# EAGLE design LED_Matrix (EAGLE 7.4.0)
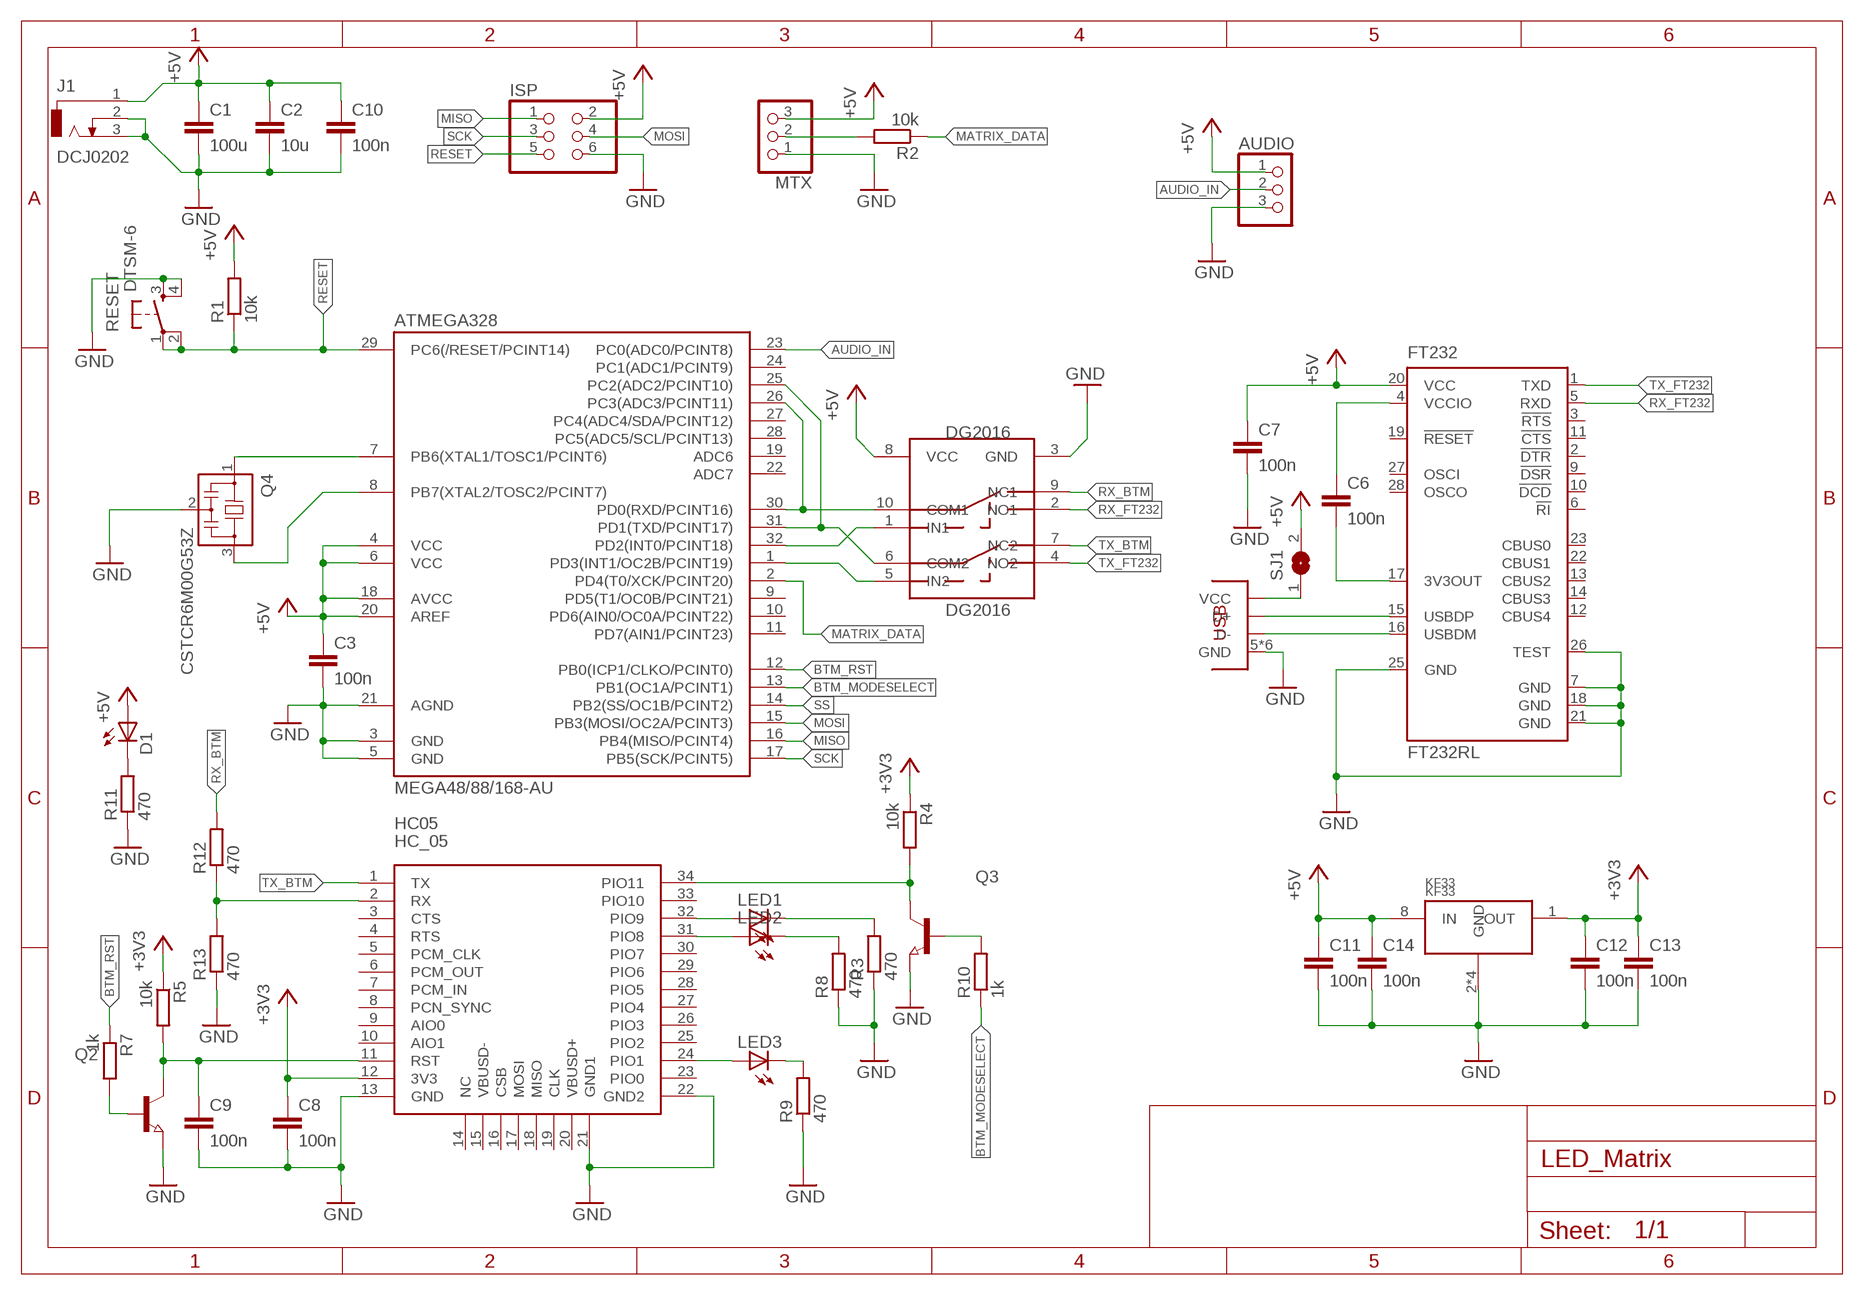
[diagram p0: schematic, sheet 1]

## Parts
ATMEGA328  MEGA48/88/168-AU  [TQFP32-08]
AUDIO  PINHD-1X3  [1X03]
C1  100u  C-EUC0805  [C0805]
C2  10u  C-EUC0805  [C0805]
C3  100n  C-EUC0805  [C0805]
C6  100n  C-EUC0805  [C0805]
C7  100n  C-EUC0805  [C0805]
C8  100n  C-EUC0805  [C0805]
C9  100n  C-EUC0805  [C0805]
C10  100n  C-EUC0805  [C0805]
C11  100n  C-EUC0805  [C0805]
C12  100n  C-EUC0805  [C0805]
C13  100n  C-EUC0805  [C0805]
C14  100n  C-EUC0805  [C0805]
D1  LEDSML0805  [SML0805]
DG2016  DG2016  [MSOP10]
FT232  FT232RL  [SSOP28]
HC05  HC_05  [BLUETOOTH_SMD]
ISP  PINHD-2X3  [2X03]
J1  DCJ0202  [DCJ0202]
KF33  KF33  [SO08]
LED1  LEDSML0805  [SML0805]
LED2  LEDSML0805  [SML0805]
LED3  LEDSML0805  [SML0805]
MTX  PINHD-1X3  [1X03]
Q2  NPN-TRANSISTOR_SOT23  [SOT23]
Q3  NPN-TRANSISTOR_SOT23  [SOT23]
Q4  CSTCR6M00G53Z  [CSTCR6M]
R1  10k  R-EU_R0805  [R0805]
R2  10k  R-EU_R0805  [R0805]
R3  470  R-EU_R0805  [R0805]
R4  10k  R-EU_R0805  [R0805]
R5  10k  R-EU_R0805  [R0805]
R7  1k  R-EU_R0805  [R0805]
R8  470  R-EU_R0805  [R0805]
R9  470  R-EU_R0805  [R0805]
R10  1k  R-EU_R0805  [R0805]
R11  470  R-EU_R0805  [R0805]
R12  470  R-EU_R0805  [R0805]
R13  470  R-EU_R0805  [R0805]
RESET  DTSM-6  [DTSM-6]
SJ1  SJ  [SJ]
USB  MINI_USB  [USB_MINI]

## Nets
+3V3: C8.1 C12.1 C13.1 HC05.12(3V3) KF33.1(OUT) R4.1 R5.1
+5V: ATMEGA328.4(VCC) ATMEGA328.6(VCC) ATMEGA328.18(AVCC) ATMEGA328.20(AREF) AUDIO.1 C1.1 C2.1 C3.1 C7.1 C10.1 C11.1 C14.1 D1.A DG2016.8(VCC) FT232.20(VCC) ISP.2 J1.1 KF33.8(IN) MTX.3 R1.2 SJ1.2
AUDIO_IN: ATMEGA328.23(PC0(ADC0/PCINT8)) AUDIO.2
BTM_MODESELECT: ATMEGA328.13(PB1(OC1A/PCINT1)) HC05.34(PIO11) Q3.3(C) R4.2 R10.1
BTM_RST: ATMEGA328.12(PB0(ICP1/CLKO/PCINT0)) R7.1
GND: ATMEGA328.3(GND) ATMEGA328.5(GND) ATMEGA328.21(AGND) AUDIO.3 C1.2 C2.2 C3.2 C7.2 C8.2 C9.2 C10.2 C11.2 C12.2 C13.2 C14.2 DG2016.3(GND) FT232.7(GND) FT232.18(GND) FT232.21(GND) FT232.25(GND) FT232.26(TEST) HC05.13(GND) HC05.21(GND1) HC05.22(GND2) ISP.6 J1.2 J1.3 KF33.2(GND) KF33.3(GND) KF33.6(GND) KF33.7(GND) MTX.1 Q2.2(E) Q3.2(E) Q4.2 R3.1 R8.1 R9.1 R11.1 R13.1 RESET.3 RESET.4 USB.5(GND) USB.GND USB.GND1(GND) USB.GND3(GND) USB.GND4(GND) USB.GND5(GND)
MATRIX_DATA: ATMEGA328.2(PD4(T0/XCK/PCINT20)) R2.1
MISO: ATMEGA328.16(PB4(MISO/PCINT4)) ISP.1
MOSI: ATMEGA328.15(PB3(MOSI/OC2A/PCINT3)) ISP.4
N$1: HC05.32(PIO9) LED1.A
N$2: SJ1.1 USB.1(VCC)
N$3: ATMEGA328.7(PB6(XTAL1/TOSC1/PCINT6)) Q4.1
N$4: MTX.2 R2.2
N$5: HC05.31(PIO8) LED2.A
N$6: LED1.C R3.2
N$7: ATMEGA328.8(PB7(XTAL2/TOSC2/PCINT7)) Q4.3
N$8: LED2.C R8.2
N$9: C6.1 FT232.4(VCCIO)
N$10: D1.C R11.2
N$11: C6.2 FT232.17(3V3OUT)
N$12: ATMEGA328.26(PC3(ADC3/PCINT11)) ATMEGA328.30(PD0(RXD/PCINT16)) DG2016.10(COM1)
N$13: FT232.16(USBDM) USB.2(D-)
N$14: FT232.15(USBDP) USB.3(D+)
N$15: ATMEGA328.25(PC2(ADC2/PCINT10)) ATMEGA328.31(PD1(TXD/PCINT17)) DG2016.6(COM2)
N$19: Q2.1(B) R7.2
N$23: C9.1 HC05.11(RST) Q2.3(C) R5.2
N$24: HC05.24(PIO1) LED3.A
N$25: LED3.C R9.2
N$26: HC05.2(RX) R12.1 R13.2
N$27: Q3.1(B) R10.2
N$28: ATMEGA328.32(PD2(INT0/PCINT18)) DG2016.1(IN1)
N$29: ATMEGA328.1(PD3(INT1/OC2B/PCINT19)) DG2016.5(IN2)
RESET: ATMEGA328.29(PC6(/RESET/PCINT14)) ISP.5 R1.1 RESET.1 RESET.2
RX_BTM: DG2016.9(NC1) R12.2
RX_FT232: DG2016.2(NO1) FT232.5(RXD)
SCK: ATMEGA328.17(PB5(SCK/PCINT5)) ISP.3
SS: ATMEGA328.14(PB2(SS/OC1B/PCINT2))
TX_BTM: DG2016.7(NC2) HC05.1(TX)
TX_FT232: DG2016.4(NO2) FT232.1(TXD)
Unconnected: ATMEGA328.9(PD5(T1/OC0B/PCINT21)) ATMEGA328.10(PD6(AIN0/OC0A/PCINT22)) ATMEGA328.11(PD7(AIN1/PCINT23)) ATMEGA328.19(ADC6) ATMEGA328.22(ADC7) ATMEGA328.24(PC1(ADC1/PCINT9)) ATMEGA328.27(PC4(ADC4/SDA/PCINT12)) ATMEGA328.28(PC5(ADC5/SCL/PCINT13)) FT232.2(!DTR) FT232.3(!RTS) FT232.6(!RI) FT232.9(!DSR) FT232.10(!DCD) FT232.11(!CTS) FT232.12(CBUS4) FT232.13(CBUS2) FT232.14(CBUS3) FT232.19(!RESET) FT232.22(CBUS1) FT232.23(CBUS0) FT232.27(OSCI) FT232.28(OSCO) HC05.3(CTS) HC05.4(RTS) HC05.5(PCM_CLK) HC05.6(PCM_OUT) HC05.7(PCM_IN) HC05.8(PCN_SYNC) HC05.9(AIO0) HC05.10(AIO1) HC05.14(NC) HC05.15(VBUSD-) HC05.16(CSB) HC05.17(MOSI) HC05.18(MISO) HC05.19(CLK) HC05.20(VBUSD+) HC05.23(PIO0) HC05.25(PIO2) HC05.26(PIO3) HC05.27(PIO4) HC05.28(PIO5) HC05.29(PIO6) HC05.30(PIO7) HC05.33(PIO10)

## Library data of the parts
ATMEGA328 = avr-5:MEGA48/88/168
AUDIO MTX = pinhead:PINHD-1X3: PIN HEADER
C1-C3 C6-C14 = rcl:C-EU: CAPACITOR, European symbol
D1 LED1-LED3 = led:LED: LED OSRAM: - CHIPLED LG R971, LG N971, LY N971, LG Q971, LY Q971, LO R971, LY R971 LH N974, LH R974 LS Q976, LO Q976, LY Q976 LO Q996 - Hyper CHIPLED LW Q18S LB Q993, LB Q99A, LB R99A - SideLED LS A670, LO A670, LY A670, LG A670, LP A670 LB A673, LV A673, LT A673, LW A673 LH A674 LY A675 LS A676, LA A676, LO A676, LY A676, LW A676 LS A679, LY A679, LG A679 - Hyper Micro SIDELED® LS Y876, LA Y876, LO Y876, LY Y876 LT Y87S - SmartLED LW L88C, LW L88S LB L89C, LB L89S, LG L890 LS L89K, LO L89K, LY L89K LS L896, LA L896, LO L896, LY L896 - TOPLED LS T670, LO T670, LY T670, LG T670, LP T670 LSG T670, LSP T670, LSY T670, LOP T670, LYG T670 LG T671, LOG T671, LSG T671 LB T673, LV T673, LT T673, LW T673 LH T674 LS T676, LA T676, LO T676, LY T676, LB T676, LH T676, LSB T676, LW T676 LB T67C, LV T67C, LT T67C, LS T67K, LO T67K, LY T67K, LW E67C LS E67B, LA E67B, LO E67B, LY E67B, LB E67C, LV E67C, LT E67C LW T67C LS T679, LY T679, LG T679 LS T770, LO T770, LY T770, LG T770, LP T770 LB T773, LV T773, LT T773, LW T773 LH T774 LS E675, LA E675, LY E675, LS T675 LS T776, LA T776, LO T776, LY T776, LB T776 LHGB T686 LT T68C, LB T68C - Hyper Mini TOPLED® LB M676 - Mini TOPLED Santana® LG M470 LS M47K, LO M47K, LY M47K Source: http://www.osram.convergy.de LUXEON: - LUMILED® LXK2-PW12-R00, LXK2-PW12-S00, LXK2-PW14-U00, LXK2-PW14-V00 LXK2-PM12-R00, LXK2-PM12-S00, LXK2-PM14-U00 LXK2-PE12-Q00, LXK2-PE12-R00, LXK2-PE12-S00, LXK2-PE14-T00, LXK2-PE14-U00 LXK2-PB12-K00, LXK2-PB12-L00, LXK2-PB12-M00, LXK2-PB14-N00, LXK2-PB14-P00, LXK2-PB14-Q00 LXK2-PR12-L00, LXK2-PR12-M00, LXK2-PR14-Q00, LXK2-PR14-R00 LXK2-PD12-Q00, LXK2-PD12-R00, LXK2-PD12-S00 LXK2-PH12-R00, LXK2-PH12-S00 LXK2-PL12-P00, LXK2-PL12-Q00, LXK2-PL12-R00 Source: www.luxeon.com KINGBRIGHT: KA-3528ASYC Source: www.kingbright.com
DG2016 = Tobias:DG2016: The DG2016/DG2026 are monolithic CMOS dual single-pole/double-throw (SPDT) analog switchs. They are specifically designed for low-voltage, high bandwidth applications. The DG2016/DG2026’s on-resistance (3  at 2.7 V), matching and flatness are guaranteed over the entire analog voltage range. Wide dynamic performance is achieved with better than - 80 dB for both cross-talk and off-isolation at 1 MHz. Both SPDT’s operate with independent control logic, conduct equally well in both directions and block signals up to the power supply level when off. Break-before-make is guaranteed. With fast switching speeds, low on-resistance, high bandwidth, and low charge injection, the DG2016/DG2026 are ideally suited for audio and video switching with high linearity. Built on Vishay Siliconix’s low voltage CMOS technology, the DG2016/DG2026 contain an epitaxial layer which prevents latch-up
FT232 = ftdichip:FT232R: Source: http://www.ftdichip.com/Documents/DataSheets/DS_FT232R_v104.pdf; MPN: FT232RL; OC_FARNELL: 1146032; OC_NEWARK: 91K9918
HC05 = debegr92:HC_05
ISP = pinhead:PINHD-2X3: PIN HEADER
J1 = con-jack:DCJ0202: DC POWER JACK Source: DCJ0202.pdf; OC_FARNELL: unknown; OC_NEWARK: unknown
KF33 = debegr92:KF33
Q2 Q3 = semicon-smd-ipc:NPN-TRANSISTOR_: NPN TRANSISTOR
Q4 = murata-filter:CSTCR: Resonator Source: murata.co.jp; MPN: CSTCR6M00G53-R0; OC_FARNELL: 1170434; OC_NEWARK: 25M8759
R1-R5 R7-R13 = rcl:R-EU_: RESISTOR, European symbol
RESET = debegr92:DTSM-6
SJ1 = jumper:SJ: SMD solder JUMPER
USB = Tobias:MINI_USB

## Board
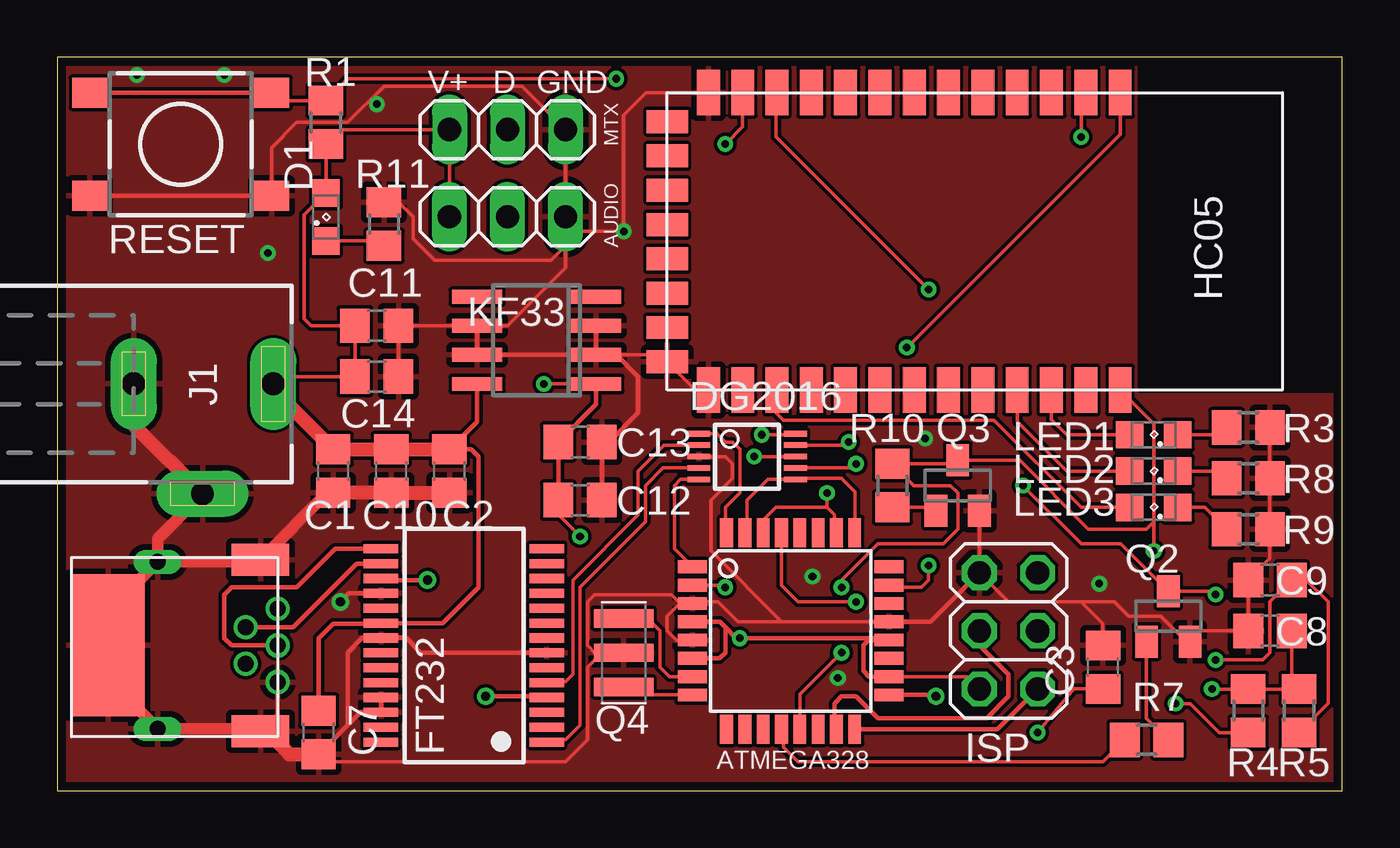
[diagram p1: board, top side]
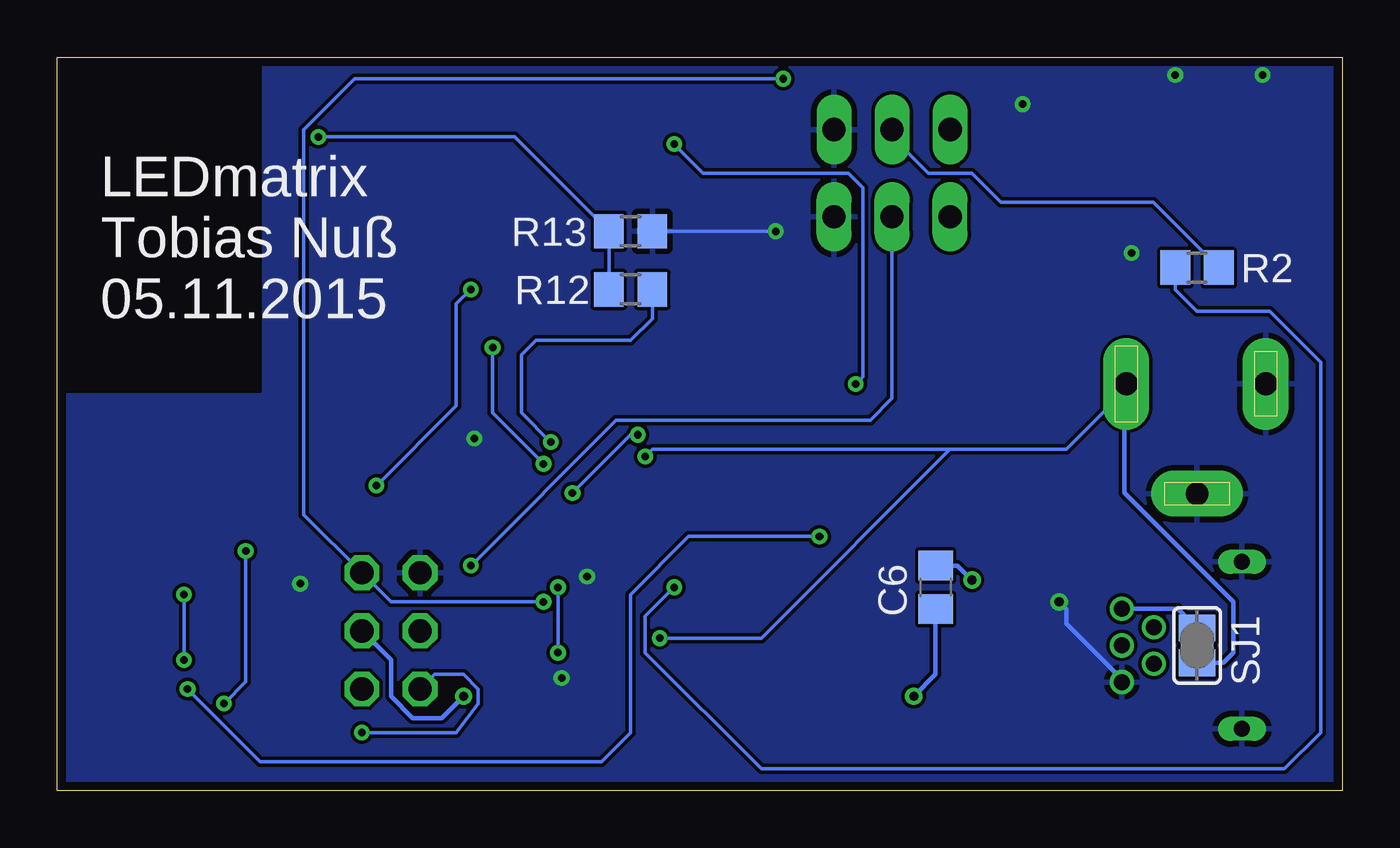
[diagram p2: board, bottom side, seen from below]

Size 56.19 x 32.06 mm. Coordinates in mm from the lower left corner, seen from the top.
Outline: 0,0 56.19,0 56.19,32.06 0,32.06 0,0
Copper layers (1*16): Top 0.0356mm / dielectric 1.5011mm / Bottom 0.0356mm
Design rules "LaenPCBOrder": minimum track width 6mil, minimum drill 13mil, track to track 6mil, track to pad 6mil, pad to pad 6mil, via to via 6mil, smd to smd 6mil, copper to edge 15mil, drill to drill 6mil, minimum pad ring 7mil, minimum via ring 7mil, stop-mask expansion 3mil, vias tented up to drill 0mil, thermal gap 10mil
tRestrict: area 47.3,17.5 to 56.2,32.1
bRestrict: area 47.3,17.5 to 56.2,32.1

### Footprints (pad centres in the part's own frame; a part is rotated, then mirrored left to right if it is on the bottom)
TQFP32-08 = smd 1.27 x 0.559: 1 -4.293,2.8; 2 -4.293,2; 3 -4.293,1.2; 4 -4.293,0.4; 5 -4.293,-0.4; 6 -4.293,-1.2; 7 -4.293,-2; 8 -4.293,-2.8; 17 4.293,-2.8; 18 4.293,-2; 19 4.293,-1.2; 20 4.293,-0.4; 21 4.293,0.4; 22 4.293,1.2; 23 4.293,2; 24 4.293,2.8 | smd 0.559 x 1.27: 9 -2.8,-4.293; 10 -2,-4.293; 11 -1.2,-4.293; 12 -0.4,-4.293; 13 0.4,-4.293; 14 1.2,-4.293; 15 2,-4.293; 16 2.8,-4.293; 25 2.8,4.293; 26 2,4.293; 27 1.2,4.293; 28 0.4,4.293; 29 -0.4,4.293; 30 -1.2,4.293; 31 -2,4.293; 32 -2.8,4.293
1X03 = drill 1.016 long: 1 -2.54,0; 2 0,0; 3 2.54,0
C0805 = smd 1.3 x 1.5: 1 -0.95,0; 2 0.95,0
SML0805 = smd 1.2 x 1.2: A 1.05,0; C -1.05,0
MSOP10 = smd 0.25 x 1: 1 -1,-2.113; 2 -0.5,-2.113; 3 0,-2.113; 4 0.5,-2.113; 5 1,-2.113; 6 1,2.113; 7 0.5,2.113; 8 0,2.113; 9 -0.5,2.113; 10 -1,2.113
SSOP28 = smd 0.4 x 1.5: 1 -4.225,-3.625; 2 -3.575,-3.625; 3 -2.925,-3.625; 4 -2.275,-3.625; 5 -1.625,-3.625; 6 -0.975,-3.625; 7 -0.325,-3.625; 8 0.325,-3.625; 9 0.975,-3.625; 10 1.625,-3.625; 11 2.275,-3.625; 12 2.925,-3.625; 13 3.575,-3.625; 14 4.225,-3.625; 15 4.225,3.625; 16 3.575,3.625; 17 2.925,3.625; 18 2.275,3.625; 19 1.625,3.625; 20 0.975,3.625; 21 0.325,3.625; 22 -0.325,3.625; 23 -0.975,3.625; 24 -1.625,3.625; 25 -2.275,3.625; 26 -2.925,3.625; 27 -3.575,3.625; 28 -4.225,3.625
BLUETOOTH_SMD = smd 2 x 1: 1 -6.7,7.1; 2 -6.7,5.6; 3 -6.7,4.1; 4 -6.7,2.6; 5 -6.7,1.1; 6 -6.7,-0.4; 7 -6.7,-1.9; 8 -6.7,-3.4; 9 -6.7,-4.9; 10 -6.7,-6.4; 11 -6.7,-7.9; 12 -6.7,-9.4; 13 -6.7,-10.9; 22 6.3,-10.9; 23 6.3,-9.4; 24 6.3,-7.9; 25 6.3,-6.4; 26 6.3,-4.9; 27 6.3,-3.4; 28 6.3,-1.9; 29 6.3,-0.4; 30 6.3,1.1; 31 6.3,2.6; 32 6.3,4.1; 33 6.3,5.6; 34 6.3,7.1 | smd 1 x 1.8: 14 -5.43,-12.7; 15 -3.93,-12.7; 16 -2.43,-12.7; 17 -0.93,-12.7; 18 0.57,-12.7; 19 2.07,-12.7; 20 3.57,-12.7; 21 5.07,-12.7
2X03 = drill 1.016 octagon: 1 -2.54,-1.27; 2 -2.54,1.27; 3 0,-1.27; 4 0,1.27; 5 2.54,-1.27; 6 2.54,1.27
DCJ0202 = drill 1 pad 2 long: 1 0,3.1; 2 4.8,0; 3 0,-3
SO08 = smd 0.6 x 2.2: 1 -1.905,-2.6; 2 -0.635,-2.6; 3 0.635,-2.6; 4 1.905,-2.6; 5 1.905,2.6; 6 0.635,2.6; 7 -0.635,2.6; 8 -1.905,2.6
SOT23 = smd 1 x 1.4: 1 -0.95,-1.1; 2 0.95,-1.1; 3 0,1.1
CSTCR6M = smd 0.8 x 2.6: 1 -1.5,0; 2 0,0; 3 1.5,0
R0805 = smd 1.3 x 1.5: 1 -0.95,0; 2 0.95,0
DTSM-6 = smd 1.55 x 1.3: 1 -3.975,2.25; 2 3.975,2.25; 3 -3.975,-2.25; 4 3.975,-2.25
SJ = smd 1.168 x 1.6: 1 -0.762,0; 2 0.762,0
USB_MINI = drill 0.7: 1 9,1.6; 2 7.6,0.8; 3 9,0; 4 7.6,-0.8; 5 9,-1.6 | smd 3.2 x 6.2: GND 1.6,0 | smd 2.5 x 1.4: GND1 8.25,3.75; GND3 8.25,-3.75 | drill 0.7 long: GND4 3.75,3.65; GND5 3.75,-3.65

### Placement (x,y rotation side)
ATMEGA328  32.07,6.99 0 top
AUDIO  19.68,25.08 0 top
C1  12.06,13.97 270 top
C2  17.14,13.97 270 top
C3  45.72,5.4 90 top
C6  17.78,8.89 90 bottom
C7  11.43,2.54 270 top
C8  53.02,6.99 180 top
C9  53.02,9.21 180 top
C10  14.61,13.97 270 top
C11  13.97,20.32 0 top
C12  22.86,12.7 0 top
C13  22.86,15.24 0 top
C14  13.97,18.1 0 top
D1  11.75,25.08 90 top
DG2016  30.16,14.61 270 top
FT232  17.78,6.35 90 top
HC05  39.37,23.81 270 top
ISP  41.59,6.99 90 top
J1  6.35,17.78 270 top
KF33  20.95,19.68 90 top
LED1  47.94,15.56 180 top
LED2  47.94,13.97 180 top
LED3  47.94,12.38 180 top
MTX  19.68,28.89 180 top
Q2  48.58,7.62 0 top
Q3  39.37,13.34 0 top
Q4  24.77,6.03 270 top
R1  11.75,29.21 270 top
R2  6.35,22.86 0 bottom
R3  52.07,15.88 180 top
R4  52.07,3.49 270 top
R5  54.29,3.49 270 top
R7  47.62,2.22 0 top
R8  52.07,13.65 180 top
R9  52.07,11.43 180 top
R10  36.51,13.34 270 top
R11  14.29,24.77 270 top
R12  31.11,21.91 0 bottom
R13  31.11,24.45 180 bottom
RESET  5.4,28.26 0 top
SJ1  6.35,6.35 270 bottom
USB  0.64,6.35 0 top

### Tracks (layer width: path | path; a pad name or v marks a point on that pad's centre or on a via)
+3V3  (via drill 0.33)
  Top 0.152: KF33.1 v21.27,17.78 | v29.21,28.26 29.97,29.02 HC05.12 | C8.1 53.97,4.76 R5.1 R4.1 v50.48,4.45 | v22.86,11.11 21.91,12.06 C12.1
  Top 0.203: KF33.1 23.55,16.89 C13.1 C12.1
  Bottom 0.152: v21.27,17.78 20.95,18.1 20.95,26.35 21.59,26.99 27.94,26.99 v29.21,28.26 | v50.48,4.45 47.31,1.27 32.38,1.27 31.11,2.54 31.11,8.57 28.57,11.11 v22.86,11.11
+5V  (via drill 0.33)
  Top 0.152: ISP.2 39.78,4.99 ATMEGA328.18 | v42.86,2.54 44.45,4.45 C3.1 | DG2016.8 v30.48,14.61 | C11.1 11.11,20.32 10.79,20.64 10.79,25.18 D1.A R1.2 12.38,28.89 MTX.3 AUDIO.1 | C11.1 | C11.1 C14.1 9.77,18.1 J1.1
  Top 0.203: C7.1 11.43,6.67 12.06,7.3 14.13,7.3 FT232.20 16.85,7.33 18.41,8.89 18.41,14.61 18.1,14.92 C2.1 18.36,16.13 KF33.8 | ATMEGA328.4 28.97,7.38 29.21,7.14 | ATMEGA328.6 28.96,5.79 29.21,6.03 29.21,7.14 | ATMEGA328.18 35.5,4.99 35.24,5.24 35.24,6.35 35.48,6.58 ATMEGA328.20 36.28,6.67 v29.84,6.67 29.69,6.67 29.21,7.14
  Top 0.61: J1.1 9.45,17.54 C1.1 C10.1 C2.1
  Bottom 0.152: ISP.2 39.69,5.08 38.42,5.08 37.78,4.45 37.78,3.81 38.73,2.54 v42.86,2.54 | v29.84,6.67 25.4,6.67 C2.1 | C2.1 C1.1 9.84,17.14 9.53,17.14 | v30.48,14.61 30.16,14.92 C2.1
  Bottom 0.203: SJ1.2 5.21,5.59 4.76,6.03 4.76,8.26 9.53,13.02 9.53,17.14 9.53,17.7 J1.1
AUDIO_IN  (via drill 0.33)
  Top 0.152: v38.1,9.84 38.1,9.21 37.78,8.89 36.45,8.89 ATMEGA328.23
  Bottom 0.152: AUDIO.2 19.68,17.14 20.64,16.19 31.75,16.19 v38.1,9.84
BTM_MODESELECT  (via drill 0.33)
  Top 0.152: v34.29,8.89 34.29,9.21 35.88,10.79 38.73,10.79 39.37,11.43 39.37,13.02 39.05,13.34 37.46,13.34 R10.1 39.22,14.29 Q3.3 42.08,14.44 45.09,11.43 47.62,11.43 47.94,11.75 | v34.29,6.03 32.47,4.21 ATMEGA328.13 | HC05.34 47.94,16.04 47.94,11.75 | R4.2 50.8,2.54 49.53,3.81 v48.9,3.81 | v47.94,10.48 47.94,11.75
  Bottom 0.152: v34.29,8.89 v34.29,6.03 | v48.9,3.81 47.94,4.76 v47.94,10.48
BTM_RST
  Top 0.152: R7.1 45.72,1.27 32.38,1.27 31.75,1.91 31.75,2.61 ATMEGA328.12
GND  (via drill 0.33, 0.41)
  Top 0.152: ATMEGA328.21 31.67,7.38 | 31.67,7.38 29.76,7.38 28.89,8.26 27.84,8.26 ATMEGA328.3 | Q4.2 23.81,6.03 | 23.81,6.03 23.18,5.4 23.18,2.22 22.23,1.27 11.75,1.27 C7.2 | ATMEGA328.5 27.07,6.58 26.67,6.99 26.67,7.62 27.23,8.19 | ATMEGA328.3 27.23,8.19 | ATMEGA328.3 27.7,8.26 | 23.81,6.03 23.5,6.03 23.18,6.35 23.18,8.26 23.5,8.57 26.85,8.57 27.23,8.19 | DG2016.3 29.21,14.61 29.53,14.29 29.53,13.65 28.57,12.7 28.57,10.48 31.67,7.38 | 24.45,19.05 26.36,19.05 HC05.21 27.9,17.51 HC05.22 | Q3.2 ISP.6 41.59,8.26 44.77,8.26 | HC05.13 25.75,30.51 24.77,29.53 v24.77,24.45 22.86,24.45 AUDIO.3 | R3.1 R8.1 R9.1 53.02,10.15 C9.2 C8.2 49.99,6.99 Q2.2 49.36,6.52 48.26,7.62 46.84,7.62 46.21,8.26 44.77,8.26 | RESET.4 9.37,28.11 10.48,29.21 12.7,29.21 14.29,30.8 20.32,30.8 MTX.1 AUDIO.3 | C14.2 C11.2 KF33.6 19.68,20.32 22.23,22.86 22.23,23.81 | 44.77,8.26 45.72,7.3 C3.2 | R11.1 14.93,25.71 15.56,25.08 15.56,24.13 16.51,23.18 21.59,23.18 22.23,23.81 | 22.23,23.81 AUDIO.3
  Top 0.203: 12.7,2.86 13.27,3.42 FT232.26 FT232.25 | 12.7,2.86 C7.2 | 12.7,2.86 12.7,6.03 13.34,6.67 FT232.21 15.25,6.67 15.9,6.03 FT232.7 | USB.5 9.63,3.35 USB.GND3 | v12.38,8.26 12.75,8.62 FT232.18 | KF33.2 KF33.7 KF33.6 | KF33.3 KF33.2 | C12.2 C13.2 24.13,15.24 25.4,16.51 25.4,18.1 24.45,19.05 KF33.2 | RESET.4 RESET.3 | ATMEGA328.21 38.18,7.38 ISP.6
  Top 0.406: 8.25,10 USB.GND1
  Top 0.508: J1.2 4.38,11.02 USB.GND4 | 8.25,10 USB.GND4 | USB.GND4 2,7.62 1.91,7.62 2.23,7.29 USB.GND 2.23,4.85 USB.GND5 8.79,2.7 USB.GND3 | USB.GND1 11.8,13.02 C1.2
  Top 0.61: USB.GND3 9.15,2.6 10.16,1.59 C7.2 | J1.3 3.35,15.98 J1.2 | C2.2 C10.2 C1.2
  Bottom 0.152: R13.1 v24.77,24.45
  Bottom 0.203: USB.5 9.63,4.87 12.06,7.3 12.06,7.94 v12.38,8.26
  other vias: 9.21,23.5 3.49,31.27 7.3,31.27 13.97,30 33.02,9.37 34.13,4.92 37.94,15.4 45.56,9.05
  pour Top: 0,32.07 56.2,32.07 56.2,0 0,0
  pour Bottom: 0,32.07 56.2,32.07 56.2,0 0,0
MATRIX_DATA  (via drill 0.33)
  Top 0.152: v29.21,8.89 29.11,8.98 ATMEGA328.2
  Bottom 0.152: R2.1 7.3,21.91 6.35,20.95 3.17,20.95 0.95,18.73 0.95,2.54 2.54,0.95 25.4,0.95 30.48,6.03 30.48,7.62 v29.21,8.89
MISO
  Top 0.203: ISP.1 41.11,2.69 ATMEGA328.16
MOSI
  Top 0.203: ISP.4 40.32,6.35 41.59,5.08 41.59,4.13 40.64,3.17 35.88,3.17 34.92,4.13 34.29,4.13 33.97,3.81 33.97,2.79 ATMEGA328.15
N$1
  Top 0.152: HC05.32 43.47,16.22 44.13,15.56 LED1.A
N$2
  Bottom 0.203: USB.1 7.19,7.95 SJ1.1
N$3
  Top 0.152: ATMEGA328.7 26.77,4.99 26.35,5.4 26.35,6.99 25.72,7.62 24.85,7.62 Q4.1
N$4
  Bottom 0.152: R2.2 8.26,25.72 14.92,25.72 16.19,26.99 18.1,26.99 19.68,28.57 MTX.2
N$5
  Top 0.152: HC05.31 41.97,16.13 44.13,13.97 LED2.A
N$6
  Top 0.152: LED1.C 50.8,15.56 R3.2
N$7
  Top 0.152: ATMEGA328.8 25.11,4.18 Q4.3
N$8
  Top 0.152: LED2.C 50.8,13.97 R8.2
N$9  (via drill 0.41)
  Top 0.203: v18.73,4.13 21.35,4.13 FT232.4
  Bottom 0.203: C6.1 17.78,5.08 v18.73,4.13
N$10
  Top 0.152: R11.2 14.07,24.03 D1.C
N$11  (via drill 0.41)
  Top 0.203: v16.19,9.21 14.22,9.21 FT232.17
  Bottom 0.203: C6.2 16.82,9.84 v16.19,9.21
N$12  (via drill 0.33)
  Top 0.152: ATMEGA328.26 33.97,11.37 33.97,12.06 33.66,12.38 | 33.66,12.38 31.43,12.38 30.87,11.82 ATMEGA328.30 | DG2016.10 32.23,15.56 v30.8,15.56 | v33.66,13.02 33.66,12.38
  Bottom 0.152: v30.8,15.56 31.11,15.56 v33.66,13.02
N$13
  Top 0.203: USB.2 10.32,7.15 13.1,9.93 FT232.16
N$14
  Top 0.203: FT232.15 12.16,10.57 10.48,8.89 7.62,8.89 7.3,8.57 7.3,6.67 7.62,6.35 USB.3
N$15
  Top 0.152: ATMEGA328.31 30.16,11.37 30.16,12.7 31.07,13.61 DG2016.6 32.32,13.65 34.29,13.65 34.87,13.07 ATMEGA328.25
N$19
  Top 0.152: Q2.1 47.62,3.17 R7.2
N$23  (via drill 0.33)
  Top 0.152: R5.2 55.56,3.81 55.56,8.26 54.61,9.21 C9.1 53.02,8.26 53.02,6.03 52.7,5.71 v50.64,5.71 | v50.64,8.57 50.49,8.72 Q2.3 46.5,10.79 44.77,10.79 v42.23,13.34 | v38.1,21.91 31.43,28.57 31.43,30.48 HC05.11
  Bottom 0.152: v50.64,5.71 v50.64,8.57 | v42.23,13.34 38.73,16.83 38.73,21.27 v38.1,21.91
N$24
  Top 0.152: LED3.A 44.77,12.38 40.96,16.19 31.75,16.19 31.43,16.51 31.43,17.48 HC05.24
N$25
  Top 0.152: LED3.C 50.17,12.38 R9.2
N$26  (via drill 0.33)
  Top 0.152: v44.77,28.57 44.77,30.31 HC05.2
  Bottom 0.152: R12.1 R13.2 36.19,28.57 v44.77,28.57
N$27
  Top 0.152: Q3.1 38.27,12.38 R10.2
N$28
  Top 0.152: ATMEGA328.32 29.16,11.38 29.21,11.43 29.21,12.38 29.84,13.02 29.84,14.92 29.53,15.24 29.21,15.24 28.84,15.61 DG2016.1
N$29
  Top 0.152: ATMEGA328.1 26.99,10.57 26.99,13.34 27.26,13.61 DG2016.5
RESET  (via drill 0.33)
  Top 0.152: ATMEGA328.29 31.67,8.97 32.38,8.26 v34.92,8.26 | RESET.2 9.72,30.16 R1.1 12.7,31.11 v24.45,31.11
  Top 0.203: RESET.1 RESET.2
  Bottom 0.152: v34.92,8.26 41.59,8.26 ISP.5 45.4,12.06 45.4,28.89 43.18,31.11 v24.45,31.11
RX_BTM  (via drill 0.33)
  Top 0.152: v34.61,15.24 34.47,15.11 DG2016.9
  Bottom 0.152: v34.61,15.24 35.88,16.51 35.88,19.05 35.24,19.68 31.11,19.68 30.16,20.64 R12.2
RX_FT232
  Top 0.152: FT232.5 21.44,4.76 22.23,4.76 22.54,5.08 22.54,9.21 25.4,12.06 25.4,13.97 26.54,15.11 DG2016.2
SCK  (via drill 0.41)
  Top 0.203: v38.42,4.13 38.36,4.18 ATMEGA328.17
  Bottom 0.203: ISP.3 41.59,5.71 41.59,4.13 40.64,3.17 39.37,3.17 v38.42,4.13
TX_BTM  (via drill 0.33)
  Top 0.152: HC05.1 46.47,28.69 v37.15,19.37 | v34.92,14.29 34.74,14.11 DG2016.7
  Bottom 0.152: v37.15,19.37 37.15,16.51 v34.92,14.29
TX_FT232
  Top 0.152: FT232.1 21.5,2.22 22.23,2.22 22.86,2.86 22.86,8.89 25.72,11.75 25.72,13.34 26.49,14.11 DG2016.4

### Text on the board
tPlace: V+ | D | GND
bPlace: LEDmatrix / Tobias Nuß / 05.11.2015